# EAGLE schematic TweakTone_V1-2 (EAGLE 6.2)
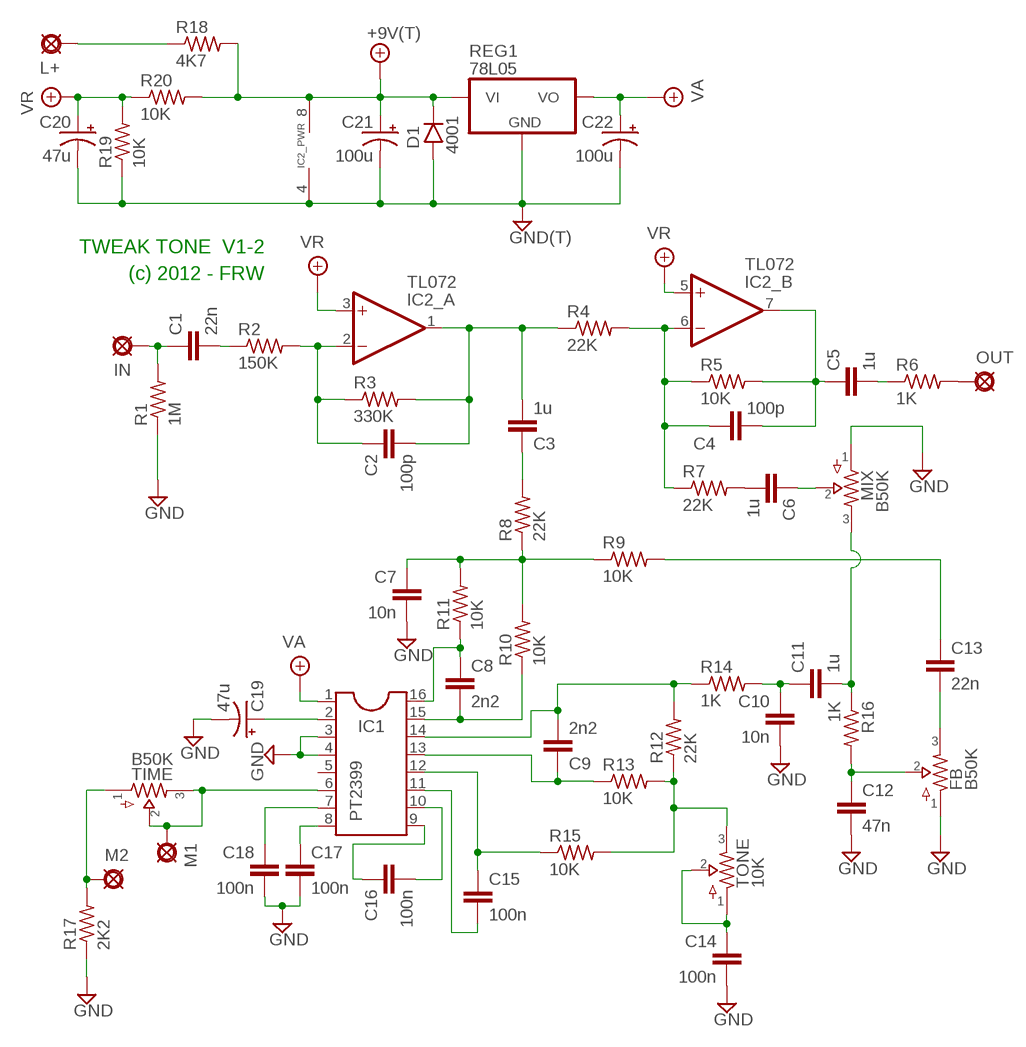
[diagram p0: schematic, sheet 1]

## Parts
+9V  +9V(T)  [SQUARE]
C1  22n  072X0252  [072X025]
C2  100p  050X030_0251  [050X030_025]
C3  1u  072X0452  [072X045]
C4  100p  050X030_0251  [050X030_025]
C5  1u  072X0452  [072X045]
C6  1u  072X0452  [072X045]
C7  10n  072X0252  [072X025]
C8  2n2  072X0252  [072X025]
C9  2n2  072X0252  [072X025]
C10  10n  072X0252  [072X025]
C11  1u  072X0452  [072X045]
C12  47n  072X0252  [072X025]
C13  22n  072X0252  [072X025]
C14  100n  072X0252  [072X025]
C15  100n  CAPS_BOX_SMALL  [SMALL-5MM]
C16  100n  CAPS_BOX_SMALL  [SMALL-5MM]
C17  100n  CAPS_BOX_SMALL  [SMALL-5MM]
C18  100n  CAPS_BOX_SMALL  [SMALL-5MM]
C19  47u  0501  [050_020_1]
C20  47u  0501  [050_020_1]
C21  100u  0501  [050_020_1]
C22  100u  0501  [050_020_1]
D1  4001  1N400X.3  [DO41-3]
FB  B50K  POTS16MM  [16MM]
GND  GND(T)  [SQUARE]
IC1  PT2399  DIL16  [DIL16]
IC2  TL072  DUALTH  [DIL08]
IN  IN  PAD  [SQUARE]
L+  IN  PAD  [SQUARE]
M1  PAD8  [OCTOGON]
M2  PAD8  [OCTOGON]
MIX  B50K  POTS16MM  [16MM]
OUT  out  PAD  [SQUARE]
R1  1M  6MM.3  [R0207/3]
R2  150K  6MM.3  [R0207/3]
R3  330K  6MM.3  [R0207/3]
R4  22K  6MM.3  [R0207/3]
R5  10K  6MM.3  [R0207/3]
R6  1K  6MM.3  [R0207/3]
R7  22K  6MM.3  [R0207/3]
R8  22K  6MM.3  [R0207/3]
R9  10K  6MM.3  [R0207/3]
R10  10K  6MM.3  [R0207/3]
R11  10K  6MM.3  [R0207/3]
R12  22K  6MM.3  [R0207/3]
R13  10K  6MM.3  [R0207/3]
R14  1K  6MM.3  [R0207/3]
R15  10K  6MM.3  [R0207/3]
R16  1K  6MM.3  [R0207/3]
R17  2K2  6MM.3  [R0207/3]
R18  4K7  6MM.3  [R0207/3]
R19  10K  6MM.3  [R0207/3]
R20  10K  6MM.3  [R0207/3]
REG1  78L05  [TO92-]
TIME  B50K  POTS16MM  [16MM]
TONE  10K  POTSTRIM  [2262_TRIM]

## Nets
+9V: +9V.1(+9V) C21.+ D1.C IC2.8(_PWR:V+) R18.2 R20.2 REG1.1(VI)
GND: C7.2 C10.2 C12.2 C14.2 C17.2 C18.2 C19.- C20.- C21.- C22.- D1.A FB.1 GND.1(GND) IC1.3 IC1.4 IC2.4(_PWR:V-) MIX.1 R1.1 R17.1 R19.1 REG1.2(GND)
N$1: C16.1 IC1.9
N$2: IC1.6 M1.1(PAD) TIME.2 TIME.3
N$3: C19.+ IC1.2
N$4: C18.1 IC1.7
N$5: M2.1(PAD) R17.2 TIME.1
N$6: C17.1 IC1.8
N$7: C16.2 IC1.10
N$8: C15.2 IC1.11
N$9: C15.1 IC1.12 R15.1
N$10: R12.1 R13.2 R15.2 TONE.3
N$11: C8.2 IC1.15 R10.1
N$12: C8.1 IC1.16 R11.1
N$13: C9.1 IC1.13 R13.1
N$14: C11.2 MIX.3 R16.1
N$15: C9.2 IC1.14 R12.2 R14.1
N$16: C12.1 FB.2 R16.2
N$17: C13.2 FB.3
N$18: C10.1 C11.1 R14.2
N$19: L+.1(PAD) R18.1
N$20: C13.1 R9.2
N$21: C3.1 R8.2
N$22: C7.1 R8.1 R9.1 R10.2 R11.2
N$23: C2.1 IC2.2(_A:-IN) R2.2 R3.1
N$24: C1.2 R2.1
N$25: C1.1 IN.1(PAD) R1.2
N$26: C2.2 C3.2 IC2.1(_A:OUT) R3.2 R4.1
N$27: C6.1 MIX.2
N$28: C4.1 IC2.6(_B:-IN) R4.2 R5.1 R7.1
N$29: C4.2 C5.1 IC2.7(_B:OUT) R5.2
N$30: C5.2 R6.1
N$31: OUT.1(PAD) R6.2
N$32: C6.2 R7.2
N$33: C14.1 TONE.1 TONE.2
VA: C22.+ IC1.1 REG1.3(VO)
VR: C20.+ IC2.3(_A:+IN) IC2.5(_B:+IN) R19.2 R20.1
Unconnected: IC1.5

## Notes on the sheet
- TWEAK TONE  V1-2
- (c) 2012 - FRW

## Library data of the parts
+9V = gm-supply:+9V(T): +9V Voltage Supply use this to hook up +9v throughout a schematic instead of running wire automatically labels the net "+9v" adds a hookup pad to the circuit board
C1 C7-C10 C12-C14 = gm-caps-film-box:072X025: 1000pF - 0.47uF WIMA MKP2 63, 100V: 1000pF - 0.015uF; MKS2 50V: 0.33 - 0.47uF; 63V: 1000pF - 0.22uF;
C2 C4 = gm-caps-ceramic:050X030_025: 47 - 120pF Xicon Ceramic Disc 2.5mm lead spacing
C3 C5 C6 C11 = gm-caps-film-box:072X045: 1.5uF WIMA MKS 2 50V: 1.5uF; 63V: 0.68uF; 100V: 0.33uF
C15-C18 = _effdub_passives:CAPS_BOX: Box Caps - 5mm Leads
C19-C22 = gm-caps-electro-pol:050: 0.22 - 100uF Xicon values at Mouser.com: 10V: 10 - 100uF; 16V: 2.2 - 47uF; 25V: 0.47 - 47uF; 50V: 0.22 - 22uF
D1 = gm-diodes:1N400X: Rectifier Diodes often used in power supply to prevent damage from reverse polarization
FB MIX TIME TONE = _effdub_pot-trim:POTS
GND = gm-supply:GND(T): Ground use this to hook up ground (GND) throughout a schematic instead of running wire automatically labels the net "GND" adds a hookup pad to the circuit board (you can use several)
IC1 = gm-ics:DIL16
IC2 = _effdub_IC:DUAL: OP AMP
IN L+ OUT = gm-supply:PAD: PAD use this package for pads with any purpose, including input, output, send or return various pad shapes: round, square, octogonal, long, and long offset
M1 M2 = _effdub_supply:PAD: PAD use this package for pads with any purpose, including input, output, send or return various pad shapes: round, square, octogonal, long, and long offset
R1-R20 = gm-resistors:6MM: 6mm Resistors Leads spaced 1-6 holes apart for 0.1" perfboard. Suitable for 1/4 watt resistors.
REG1 = _effdub_regulators:78L05